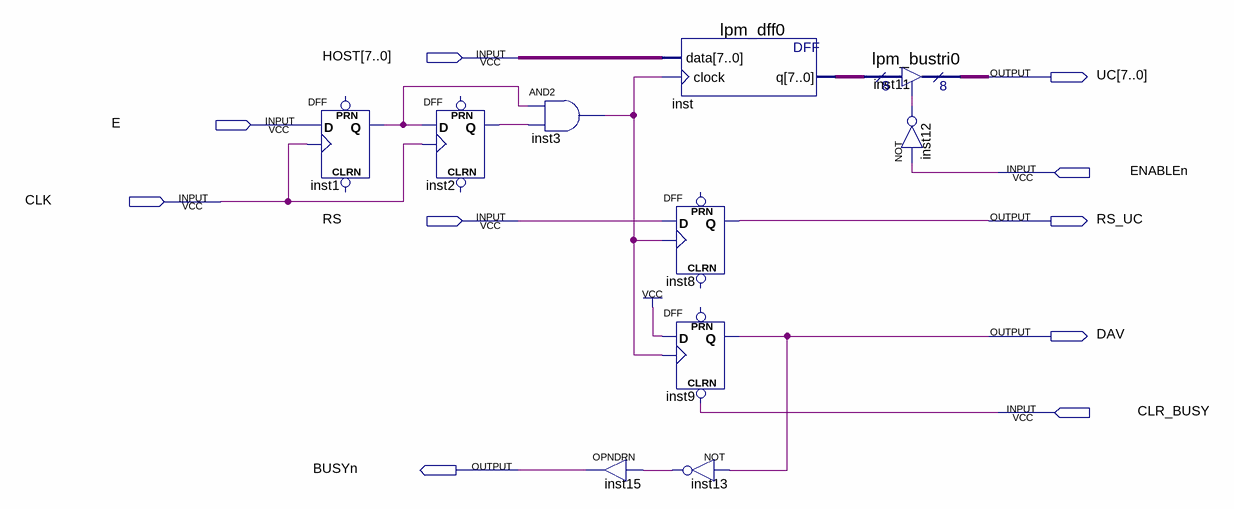
[diagram p0: schematic sheet]
// Quartus schematic VGA4.bdf as structural Verilog: 10 symbols, 10 pins
module VGA4 (
  input  [7:0] HOST,
  input  E,
  input  ENABLEn,
  input  CLK,
  input  RS,
  input  CLR_BUSY,
  output [7:0] UC,
  output RS_UC,
  output DAV,
  output BUSYn
);

  wire inst1_q, inst2_q, inst3_out, inst12_out, inst13_out;
  wire [7:0] inst_q;

  DFF inst1 (.CLK(CLK), .D(E), .Q(inst1_q));  // open: CLRN, PRN
  DFF inst2 (.CLK(CLK), .D(inst1_q), .Q(inst2_q));  // open: CLRN, PRN
  and inst3 (inst3_out, inst1_q, inst2_q);
  OPNDRN inst15 (.IN(inst13_out), .OUT(BUSYn));
  lpm_dff0 inst (.data(HOST), .clock(inst3_out), .q(inst_q));
  DFF inst8 (.CLK(inst3_out), .D(RS), .Q(RS_UC));  // open: CLRN, PRN
  DFF inst9 (.CLRN(CLR_BUSY), .CLK(inst3_out), .D(1'b1), .Q(DAV));  // open: PRN
  not inst13 (inst13_out, DAV);
  lpm_bustri0 inst11 (.enabledt(inst12_out), .data(inst_q), .tridata(UC));
  not inst12 (inst12_out, ENABLEn);
endmodule
